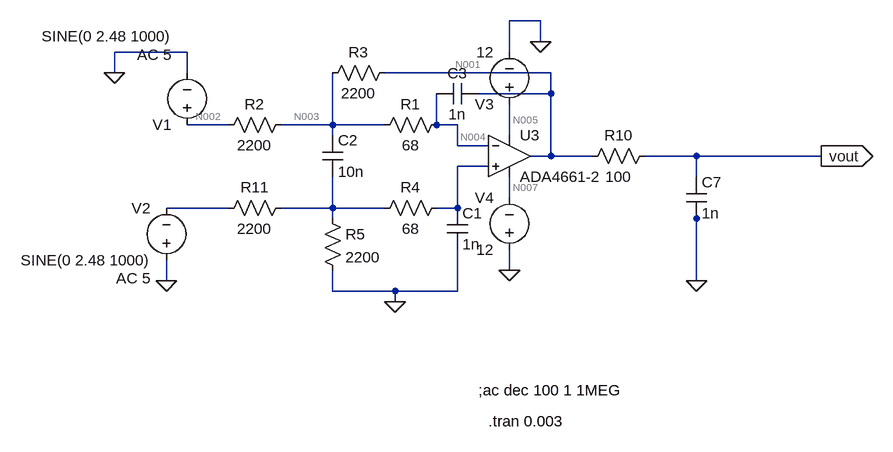
[diagram p0: schematic output differential to single circuit model.asc]
output differential to single circuit model.asc, the LTspice schematic file:
Version 4
SHEET 1 1768 680
WIRE 864 -32 816 -32
WIRE 864 0 864 -32
WIRE 320 16 208 16
WIRE 816 16 816 -32
WIRE 208 48 208 16
WIRE 320 48 320 16
WIRE 880 48 624 48
WIRE 880 80 880 48
WIRE 880 80 768 80
WIRE 384 128 320 128
WIRE 544 128 544 48
WIRE 544 128 464 128
WIRE 624 128 544 128
WIRE 704 128 704 80
WIRE 736 128 704 128
WIRE 544 144 544 128
WIRE 816 144 816 96
WIRE 736 160 736 128
WIRE 784 160 736 160
WIRE 880 176 880 80
WIRE 880 176 848 176
WIRE 944 176 880 176
WIRE 1104 176 1024 176
WIRE 1296 176 1104 176
WIRE 784 192 736 192
WIRE 1104 208 1104 176
WIRE 816 240 816 208
WIRE 384 256 288 256
WIRE 544 256 544 208
WIRE 544 256 464 256
WIRE 624 256 544 256
WIRE 736 256 736 192
WIRE 736 256 704 256
WIRE 544 272 544 256
WIRE 1104 272 1104 256
WIRE 816 352 816 320
WIRE 288 368 288 336
WIRE 1104 368 1104 272
WIRE 544 384 544 352
WIRE 640 384 544 384
WIRE 736 384 736 320
WIRE 736 384 640 384
WIRE 640 400 640 384
FLAG 1104 368 0
FLAG 1296 176 vout
IOPIN 1296 176 Out
FLAG 816 352 0
FLAG 864 0 0
FLAG 640 400 0
FLAG 288 368 0
FLAG 208 48 0
SYMBOL voltage 320 144 R180
WINDOW 3 24 152 Left 2
WINDOW 123 24 124 Left 2
WINDOW 39 0 0 Left 0
SYMATTR InstName V1
SYMATTR Value SINE(0 2.48 1000)
SYMATTR Value2 AC 5
SYMBOL res 720 112 R90
WINDOW 0 0 56 VBottom 2
WINDOW 3 32 56 VTop 2
SYMATTR InstName R1
SYMATTR Value 68
SYMBOL res 480 112 R90
WINDOW 0 0 56 VBottom 2
WINDOW 3 32 56 VTop 2
SYMATTR InstName R2
SYMATTR Value 2200
SYMBOL res 640 32 R90
WINDOW 0 0 56 VBottom 2
WINDOW 3 32 56 VTop 2
SYMATTR InstName R3
SYMATTR Value 2200
SYMBOL cap 528 144 R0
SYMATTR InstName C2
SYMATTR Value 10n
SYMBOL res 1040 160 R90
WINDOW 0 0 56 VBottom 2
WINDOW 3 32 56 VTop 2
SYMATTR InstName R10
SYMATTR Value 100
SYMBOL cap 1088 208 R0
SYMATTR InstName C7
SYMATTR Value 1n
SYMBOL voltage 816 112 R180
WINDOW 123 0 0 Left 0
WINDOW 39 0 0 Left 0
SYMATTR InstName V3
SYMATTR Value 12
SYMBOL voltage 816 336 R180
WINDOW 0 24 96 Left 2
WINDOW 3 24 16 Left 2
WINDOW 123 0 0 Left 0
WINDOW 39 0 0 Left 0
SYMATTR InstName V4
SYMATTR Value 12
SYMBOL Opamps\\ADA4661-2 816 112 R0
SYMATTR InstName U3
SYMBOL res 480 240 R90
WINDOW 0 0 56 VBottom 2
WINDOW 3 32 56 VTop 2
SYMATTR InstName R11
SYMATTR Value 2200
SYMBOL res 720 240 R90
WINDOW 0 0 56 VBottom 2
WINDOW 3 32 56 VTop 2
SYMATTR InstName R4
SYMATTR Value 68
SYMBOL cap 720 256 R0
SYMATTR InstName C1
SYMATTR Value 1n
SYMBOL res 528 256 R0
SYMATTR InstName R5
SYMATTR Value 2200
SYMBOL cap 768 64 R90
WINDOW 0 0 32 VBottom 2
WINDOW 3 32 32 VTop 2
SYMATTR InstName C3
SYMATTR Value 1n
SYMBOL voltage 288 352 R180
WINDOW 0 24 96 Left 2
WINDOW 3 24 16 Left 2
WINDOW 123 24 -12 Left 2
WINDOW 39 0 0 Left 0
SYMATTR InstName V2
SYMATTR Value SINE(0 2.48 1000)
SYMATTR Value2 AC 5
TEXT 768 536 Left 2 !;ac dec 100 1 1MEG
TEXT 784 584 Left 2 !.tran 0.003

The netlist it stands for:
* output differential to single circuit model.asc
V1 N002 0 SINE(0 2.48 1000) AC 5
R1 N004 N003 68
R2 N003 N002 2200
R3 N001 N003 2200
C2 N003 N009 10n
R10 vout N001 100
C7 vout 0 1n
V3 N005 0 12
V4 0 N007 12
XU3 N006 N004 N005 N007 N001 ADA4661-2  ; pins In+ In- V+ V- OUT
R11 N009 N008 2200
R4 N006 N009 68
C1 N006 0 1n
R5 N009 0 2200
C3 N001 N004 1n
V2 0 N008 SINE(0 2.48 1000) AC 5
;ac dec 100 1 1MEG
.tran 0.003
.lib ADI1.lib
.backanno
.end

* Results of the author's LTspice run, read from the files saved beside the schematic
* Operating Point, zero values left out:
*   V(n004) = 510.9 µV
*   V(n003) = 510.9 µV
*   V(n001) = 1.022 mV
*   V(vout) = 1.022 mV
*   V(n005) = 12 V
*   V(n007) = -12 V
*   I(R4) = -1.5 pA
*   I(R3) = 232.2 nA
*   I(R2) = 232.2 nA
*   I(R1) = 1.5 pA
*   I(V4) = -650.9 µA
*   I(V3) = -651.1 µA
*   I(V1) = 232.2 nA
*   Ix(u3:1) = 1.5 pA
*   Ix(u3:2) = -1.5 pA
*   Ix(u3:99) = 651.1 µA
*   Ix(u3:50) = -650.9 µA
*   Ix(u3:45) = -232.2 nA
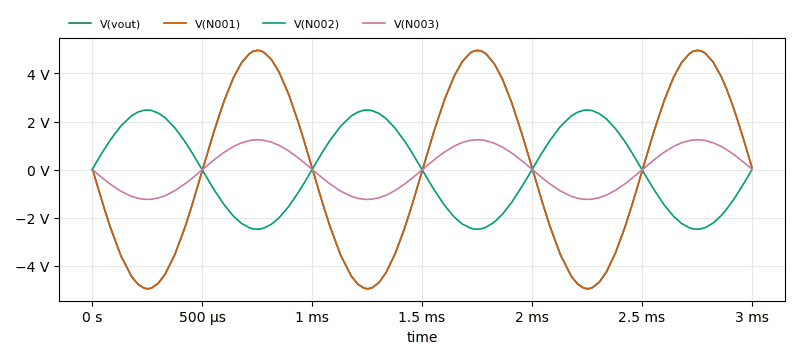
[diagram p1: Transient Analysis of output differential to single circuit model.asc, plotted from the saved traces]
* Transient Analysis, 1 run:
*   V(vout): min -4.959 V, max 4.961 V, average 1.858 mV, rms 3.505 V, last 79.09 mV
*   V(N001): min -4.959 V, max 4.961 V, average 1.86 mV, rms 3.505 V, last 75.97 mV
*   V(N002): min -2.48 V, max 2.479 V, average -424.2 µV, rms 1.752 V, last 0 V
*   V(N003): min -1.239 V, max 1.241 V, average 729.2 µV, rms 876.3 mV, last 12.3 mV